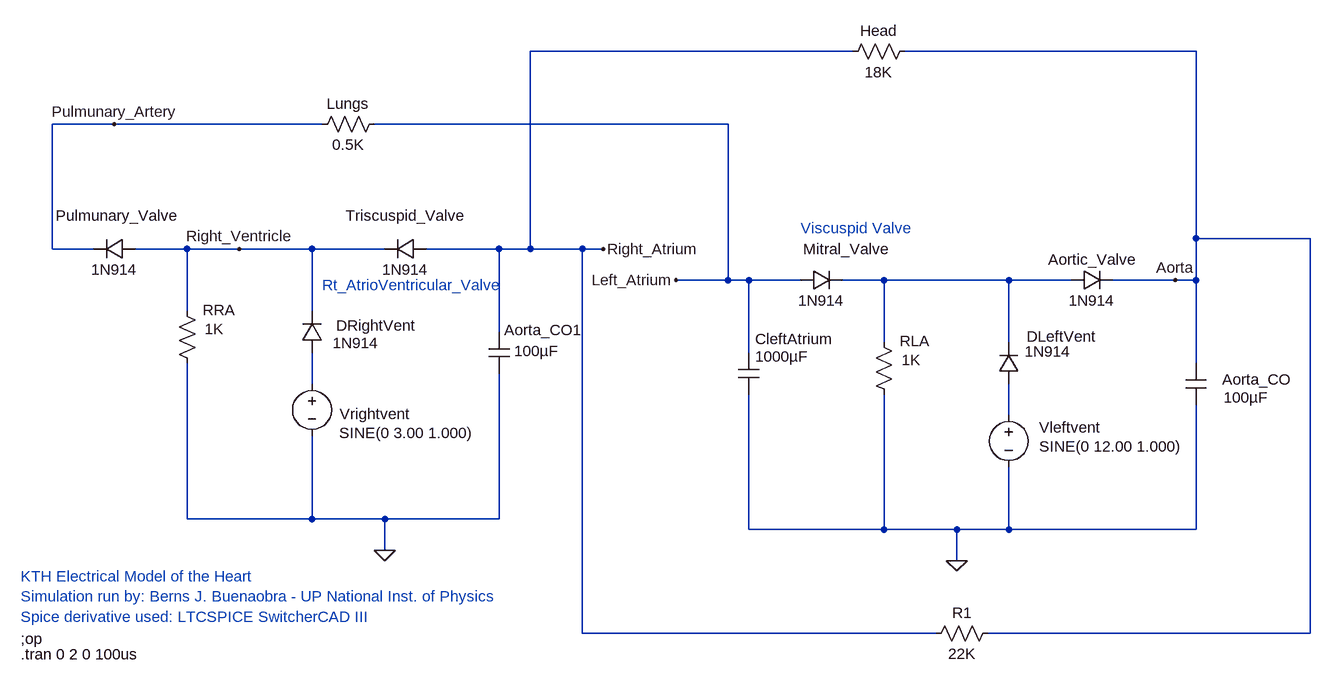
[diagram p0: schematic Heart EE model rev0.asc]
Heart EE model rev0.asc, the LTspice schematic file:
Version 4
SHEET 1 1132 768
WIRE -1072 32 -1072 -160
WIRE -1008 32 -1072 32
WIRE -976 -160 -1072 -160
WIRE -864 32 -944 32
WIRE -864 128 -864 32
WIRE -864 448 -864 208
WIRE -784 32 -864 32
WIRE -672 32 -784 32
WIRE -672 128 -672 32
WIRE -672 240 -672 192
WIRE -672 448 -864 448
WIRE -672 448 -672 320
WIRE -656 -160 -976 -160
WIRE -560 32 -672 32
WIRE -560 448 -672 448
WIRE -560 496 -560 448
WIRE -384 32 -496 32
WIRE -384 160 -384 32
WIRE -384 448 -560 448
WIRE -384 448 -384 224
WIRE -336 32 -384 32
WIRE -336 32 -336 -272
WIRE -256 32 -336 32
WIRE -256 624 -256 32
WIRE -224 32 -256 32
WIRE -32 -160 -576 -160
WIRE -32 80 -112 80
WIRE -32 80 -32 -160
WIRE 0 80 -32 80
WIRE 0 192 0 80
WIRE 0 464 0 256
WIRE 80 80 0 80
WIRE 160 -272 -336 -272
WIRE 208 80 144 80
WIRE 208 176 208 80
WIRE 208 464 0 464
WIRE 208 464 208 256
WIRE 288 624 -256 624
WIRE 320 464 208 464
WIRE 320 512 320 464
WIRE 400 80 208 80
WIRE 400 176 400 80
WIRE 400 288 400 240
WIRE 400 464 320 464
WIRE 400 464 400 368
WIRE 496 80 400 80
WIRE 656 80 560 80
WIRE 688 -272 240 -272
WIRE 688 16 688 -272
WIRE 688 80 656 80
WIRE 688 80 688 16
WIRE 688 208 688 80
WIRE 688 464 400 464
WIRE 688 464 688 272
WIRE 864 16 688 16
WIRE 864 624 368 624
WIRE 864 624 864 16
FLAG -224 32 Right_Atrium
FLAG -112 80 Left_Atrium
FLAG -784 32 Right_Ventricle
FLAG -560 496 0
FLAG 320 512 0
FLAG 656 80 Aorta
FLAG -976 -160 Pulmunary_Artery
SYMBOL cap -16 192 R0
WINDOW 0 26 -21 Left 0
WINDOW 3 26 6 Left 0
SYMATTR InstName CleftAtrium
SYMATTR Value 1000µF
SYMBOL diode 80 96 R270
WINDOW 0 48 70 VTop 0
WINDOW 3 0 32 VBottom 0
SYMATTR InstName Mitral_Valve
SYMATTR Value 1N914
SYMBOL res 192 160 R0
WINDOW 0 40 14 Left 0
WINDOW 3 43 43 Left 0
SYMATTR InstName RLA
SYMATTR Value 1K
SYMBOL diode 416 240 R180
WINDOW 0 -119 73 Left 0
WINDOW 3 -80 50 Left 0
SYMATTR InstName DLeftVent
SYMATTR Value 1N914
SYMBOL voltage 400 272 R0
WINDOW 0 47 35 Left 0
WINDOW 3 47 64 Left 0
WINDOW 123 0 0 Left 0
WINDOW 39 0 0 Left 0
SYMATTR InstName Vleftvent
SYMATTR Value SINE(0 12.00 1.000)
SYMBOL cap 672 208 R0
WINDOW 0 56 25 Left 0
WINDOW 3 59 53 Left 0
SYMATTR InstName Aorta_CO
SYMATTR Value 100µF
SYMBOL diode 496 96 R270
WINDOW 0 32 32 VTop 0
WINDOW 3 0 32 VBottom 0
SYMATTR InstName Aortic_Valve
SYMATTR Value 1N914
SYMBOL diode -944 16 R90
WINDOW 0 -20 28 VBottom 0
WINDOW 3 32 32 VTop 0
SYMATTR InstName Pulmunary_Valve
SYMATTR Value 1N914
SYMBOL res -880 112 R0
WINDOW 0 40 14 Left 0
WINDOW 3 43 43 Left 0
SYMATTR InstName RRA
SYMATTR Value 1K
SYMBOL diode -656 192 R180
WINDOW 0 -144 42 Left 0
WINDOW 3 -87 15 Left 0
SYMATTR InstName DRightVent
SYMATTR Value 1N914
SYMBOL voltage -672 224 R0
WINDOW 0 43 62 Left 0
WINDOW 3 42 91 Left 0
WINDOW 123 0 0 Left 0
WINDOW 39 0 0 Left 0
SYMATTR InstName Vrightvent
SYMATTR Value SINE(0 3.00 1.000)
SYMBOL cap -400 160 R0
WINDOW 0 24 -3 Left 0
WINDOW 3 39 29 Left 0
SYMATTR InstName Aorta_CO1
SYMATTR Value 100µF
SYMBOL diode -496 16 R90
WINDOW 0 -20 32 VBottom 0
WINDOW 3 32 32 VTop 0
SYMATTR InstName Triscuspid_Valve
SYMATTR Value 1N914
SYMBOL res -560 -176 R90
WINDOW 0 0 56 VBottom 0
WINDOW 3 32 56 VTop 0
SYMATTR InstName Lungs
SYMATTR Value 0.5K
SYMBOL res 256 -288 R90
WINDOW 0 0 56 VBottom 0
WINDOW 3 32 56 VTop 0
SYMATTR InstName Head
SYMATTR Value 18K
SYMBOL res 384 608 R90
WINDOW 0 0 56 VBottom 0
WINDOW 3 32 56 VTop 0
SYMATTR InstName R1
SYMATTR Value 22K
TEXT -656 88 Left 0 ;Rt_AtrioVentricular_Valve
TEXT -1120 632 Left 0 !;op
TEXT 80 0 Left 0 ;Viscuspid Valve
TEXT -1120 536 Left 0 ;KTH Electrical Model of the Heart\nSimulation run by: Berns J. Buenaobra - UP National Inst. of Physics\nSpice derivative used: LTCSPICE SwitcherCAD III
TEXT -1120 656 Left 0 !.tran 0 2 0 100us

The netlist it stands for:
* Heart EE model rev0.asc
CleftAtrium Left_Atrium 0 1000µF
D§Mitral_Valve Left_Atrium N002 1N914
RLA N002 0 1K
DLeftVent N003 N002 1N914
Vleftvent N003 0 SINE(0 12.00 1.000)
C§Aorta_CO Aorta 0 100µF
D§Aortic_Valve N002 Aorta 1N914
D§Pulmunary_Valve Right_Ventricle Pulmunary_Artery 1N914
RRA Right_Ventricle 0 1K
DRightVent N001 Right_Ventricle 1N914
Vrightvent N001 0 SINE(0 3.00 1.000)
C§Aorta_CO1 Right_Atrium 0 100µF
D§Triscuspid_Valve Right_Atrium Right_Ventricle 1N914
R§Lungs Left_Atrium Pulmunary_Artery 0.5K
R§Head Aorta Right_Atrium 18K
R1 Aorta Right_Atrium 22K
.model D D
.lib standard.dio
* Rt_AtrioVentricular_Valve
;op
* Viscuspid Valve
* KTH Electrical Model of the Heart
* Simulation run by: Berns J. Buenaobra - UP National Inst. of Physics
* Spice derivative used: LTCSPICE SwitcherCAD III
.tran 0 2 0 100us
.backanno
.end